# Altium schematic sheet analog channel (ABS AMP).schdoc
size A4; DrawnBy: SML; Revision: 0; SheetNumber: 2
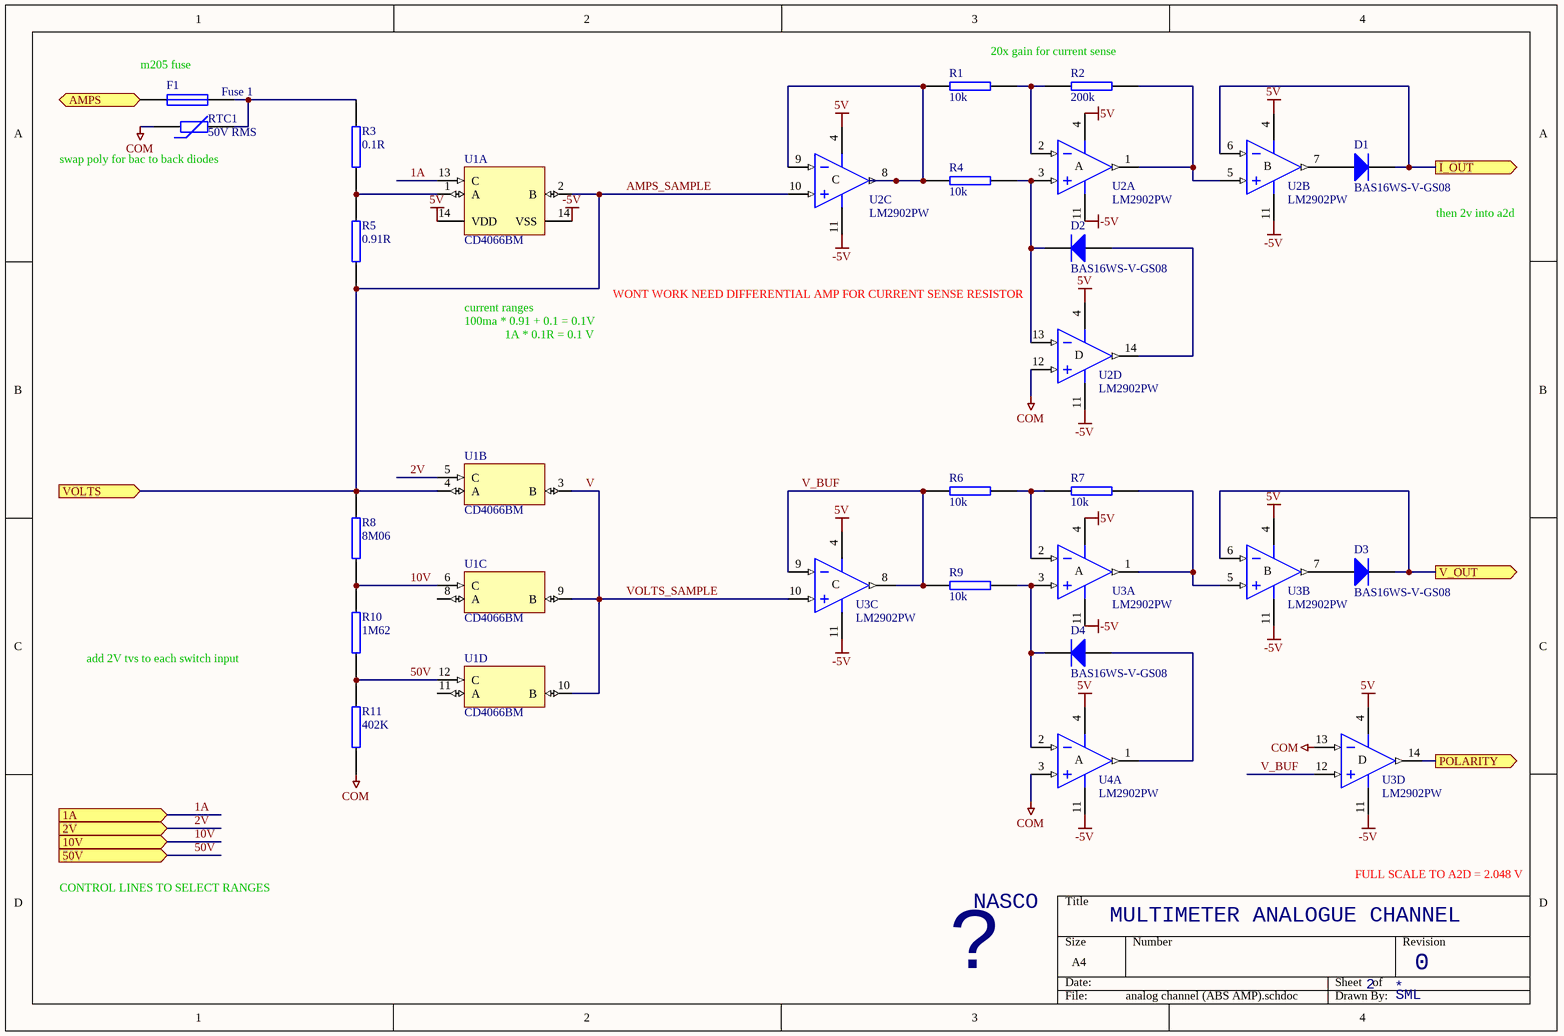
[diagram p0: analog channel (ABS AMP).schdoc]

## Parts
D1  BAS16WS-V-GS08  [SMC]
D2  BAS16WS-V-GS08  [SMC]
D3  BAS16WS-V-GS08  [SMC]
D4  BAS16WS-V-GS08  [SMC]
F1  Fuse 1  [PIN-W2/E2.8]
R1  10k  [RES(3D) - 0603]
R2  200k  [RES(3D) - 0603]
R3  0.1R  [RES (3D) - 0805]
R4  10k  [RES(3D) - 0603]
R5  0.91R  [RES (3D) - 0805]
R6  10k  [RES(3D) - 0603]
R7  10k  [RES(3D) - 0603]
R8  8M06  [RES(3D) - 0603]
R9  10k  [RES(3D) - 0603]
R10  1M62  [RES(3D) - 0603]
R11  402K  [RES(3D) - 0603]
RTC1  50V RMS  [6-0805_N]
U1  CD4066BM  [D014_N]  (parts A,B,C,D of 4)
U2  LM2902PW  [PW014_N]  (parts A,B,C,D of 4)
U3  LM2902PW  [PW014_N]  (parts A,B,C,D of 4)
U4  LM2902PW  [PW014_N]  (part A of 4)

## Ports
1A (in), 2V (in), 10V (in), 50V (in), AMPS (in), I_OUT (out), POLARITY (out), V_OUT (out), VOLTS (in)

## Nets
5V: U1.14(VDD) U2.4(V+) U3.4(V+) U4.4(V+)
-5V: U1.14(VSS) U2.11(V-) U3.11(V-) U4.11(V-)
COM: R11.2 RTC1.1 U2.12(IN+) U3.13(IN-) U4.3(IN+)
1A: U1.13(C) ; port 1A
2V: U1.5(C) ; port 2V
10V: R8.2 R10.1 U1.6(C) ; port 10V
50V: R10.2 R11.1 U1.12(C) ; port 50V
AMPS: F1.1 ; port AMPS
AMPS_SAMPLE: R5.2 R8.1 U1.2(B) U1.4(A) U2.10(IN+) ; port VOLTS
I_OUT: D1.2(K) U2.6(IN-) ; port I_OUT
POLARITY: U3.14(OUT) ; port POLARITY
V: U1.3(B) U1.9(B) U1.10(B) U3.10(IN+)  [also labelled VOLTS_SAMPLE]
V_BUF: R6.1 R9.1 U3.8(OUT) U3.9(IN-) U3.12(IN+)
V_OUT: D3.2(K) U3.6(IN-) ; port V_OUT
NetD1_1: D1.1(A) U2.7(OUT)
NetD2_1: D2.1(A) U2.14(OUT)
NetD2_2: D2.2(K) R4.2 U2.3(IN+) U2.13(IN-)
NetD3_1: D3.1(A) U3.7(OUT)
NetD4_1: D4.1(A) U4.1(OUT)
NetD4_2: D4.2(K) R9.2 U3.3(IN+) U4.2(IN-)
NetF1_2: F1.2 R3.1 RTC1.2
NetR1_1: R1.1 R4.1 U2.8(OUT) U2.9(IN-)
NetR1_2: R1.2 R2.1 U2.2(IN-)
NetR2_2: R2.2 U2.1(OUT) U2.5(IN+)
NetR3_2: R3.2 R5.1 U1.1(A)
NetR6_2: R6.2 R7.1 U3.2(IN-)
NetR7_2: R7.2 U3.1(OUT) U3.5(IN+)

Not connected (* = marked no-connect by the designer): U1 8(A) 11(A)

## Notes on the sheet
- (near F1) m205 fuse
- 20x gain for current sense
- (near RTC1) swap poly for bac to back diodes
- then 2v into a2d
- current ranges
- WONT WORK NEED DIFFERENTIAL AMP FOR CURRENT SENSE RESISTOR
- 100ma * 0.91 + 0.1 = 0.1V
- 1A * 0.1R = 0.1 V
- add 2V tvs to each switch input
- CONTROL LINES TO SELECT RANGES
- NASCO
- MULTIMETER ANALOGUE CHANNEL
- FULL SCALE TO A2D = 2.048 V
- ?
- (in symbol LM2902PW, part A) A
- (in symbol LM2902PW, part B) B
- (in symbol LM2902PW, part C) C
- (in symbol LM2902PW, part D) D

## Library data of the parts
D1-D4 = Diode: Default Diode
F1 = Fuse 1: Fuse
R1 R2 R4 R6 R7 R9 = RES SMD 0603 10k: RESISTOR SMD 0603 10k; Manufacturer: Bourns; Manufacturer Part No.: CR0603FX-1002ELF; Mouser Part no.: 652-CR0603FX-1002ELF; Web link: http://au.mouser.com/Search/Refine.aspx?Keyword=652-CR0603FX-1002ELF
  R1 R4 R6 R7 R9: value: 10k
  R2: value: 200k
R3 = RES SMD 0603 10k: RESISTOR SMD 0603 10k; Manufacturer: Bourns; Manufacturer Part No.: CRL0805-JW-R100ELF; Mouser Part no.: 652-CRL0805JWR100ELF; Web link: http://au.mouser.com/ProductDetail/Bourns/CRL0805-JW-R100ELF/?qs=OcJ73dDx4S1BYPUlNdh2oX8MYb7yqiVL9MwoZf0g6DQ%3d; value: 0.1R
R5 = RES SMD 0603 10k: RESISTOR SMD 0603 10k; Manufacturer: Bourns; Manufacturer Part No.: 73L3R91J; Mouser Part no.: 774-73L3R91J; Web link: http://au.mouser.com/ProductDetail/CTS-Electronic-Components/73L3R91J/?qs=hbgUSdfWRJXF2S%252b4sfxunP%252bHJtPQRyxQEmtazn8jM1k%3d; value: 0.91R
R8 = RES SMD 0603 10k: RESISTOR SMD 0603 10k; Manufacturer: Vishay/Dale; Manufacturer Part No.: CRCW06038M06FKEA; Mouser Part no.: 71-CRCW0603-8.06M-E3; Web link: http://au.mouser.com/ProductDetail/Vishay/CRCW06038M06FKEA/?qs=y%252bMD5VLd6nuCUjzPeM%2fNuA%3d%3d; value: 8M06
R10 = RES SMD 0603 10k: RESISTOR SMD 0603 10k; Manufacturer: 71-CRCW0603-1.62M-E3; Manufacturer Part No.: CRCW06031M62FKEA; Mouser Part no.: Vishay/Dale; Web link: http://au.mouser.com/ProductDetail/Vishay-Dale/CRCW06031M62FKEA/?qs=T8SocJY5PJGlLyODpclhGBx5u7VrWxQmuiInBv9Pchc%3d; value: 1M62
R11 = RES SMD 0603 10k: RESISTOR SMD 0603 10k; Manufacturer: Bourns; Manufacturer Part No.: CR0603-FX-4023ELF; Mouser Part no.: 652-CR0603FX-4023ELF; Web link: http://au.mouser.com/ProductDetail/Bourns/CR0603-FX-4023ELF/?qs=CCIlxZRRv7hRewWAQVeYixsXJHKBwWzIKb4pmwbbEsQ%3d; value: 402K
RTC1 = Res Varistor: Varistor (Voltage-Sensitive Resistor); Manufacturer: Bourns; Manufacturer Part No.: MOV-07D820K; Mouser Part no.: 652-MOV-07D820K; value: 50V RMS; Web link: http://au.mouser.com/ProductDetail/Bourns/MOV-07D820K/?qs=lgttKnAd%252b2CRCfoU6gfMM5wTjxZztzy8loyDV9tN%2fn8%3d
U1 = CD4066: Quadruple Bilateral Analog Switch; Mouser Part Number: 595-CD4066BM
U2-U4 = LM2902PW: Quadruple Operational Amplifier